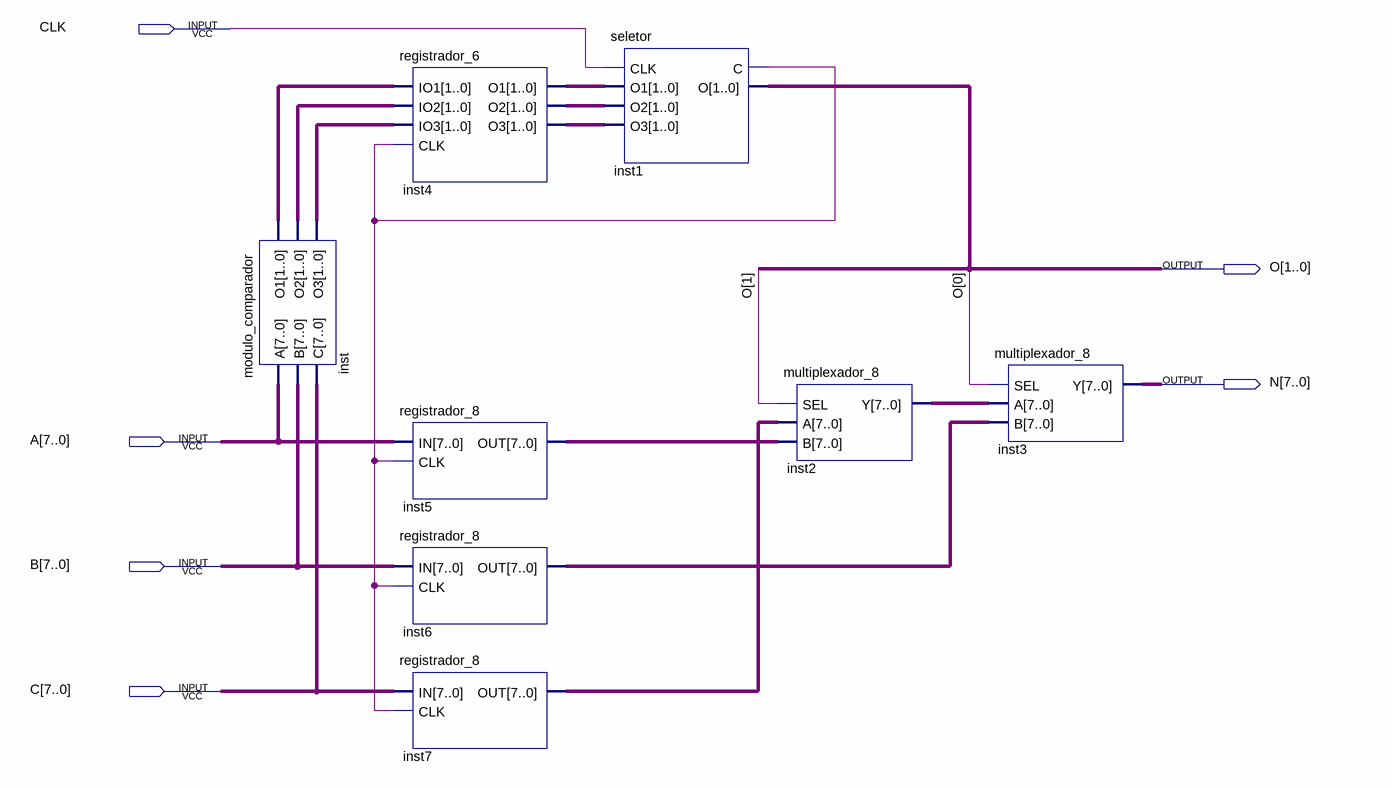
[diagram p0: schematic sheet]
// Quartus schematic modulo_seletor.bdf as structural Verilog: 8 symbols, 6 pins
module modulo_seletor (
  input  CLK,
  input  [7:0] A,
  input  [7:0] B,
  input  [7:0] C,
  output [1:0] O,
  output [7:0] N
);

  wire inst1_c;
  wire [1:0] inst4_o1, inst4_o2, inst4_o3, inst_o1, inst_o2, inst_o3;
  wire [7:0] inst2_y, inst5_out, inst6_out, inst7_out;

  modulo_comparador inst (.A(A), .B(B), .C(C), .O1(inst_o1), .O2(inst_o2), .O3(inst_o3));
  registrador_6 inst4 (
    .IO1(inst_o1), .IO2(inst_o2), .IO3(inst_o3), .CLK(inst1_c), .O1(inst4_o1), .O2(inst4_o2), .O3(inst4_o3));
  registrador_8 inst5 (.IN(A), .CLK(inst1_c), .OUT(inst5_out));
  registrador_8 inst6 (.IN(B), .CLK(inst1_c), .OUT(inst6_out));
  registrador_8 inst7 (.IN(C), .CLK(inst1_c), .OUT(inst7_out));
  seletor inst1 (.CLK(CLK), .O1(inst4_o1), .O2(inst4_o2), .O3(inst4_o3), .C(inst1_c), .O(O));
  multiplexador_8 inst2 (.SEL(O[1]), .A(inst7_out), .B(inst5_out), .Y(inst2_y));
  multiplexador_8 inst3 (.SEL(O[0]), .A(inst2_y), .B(inst6_out), .Y(N));
endmodule
